# Altium schematic sheet Power.SchDoc
size Legal
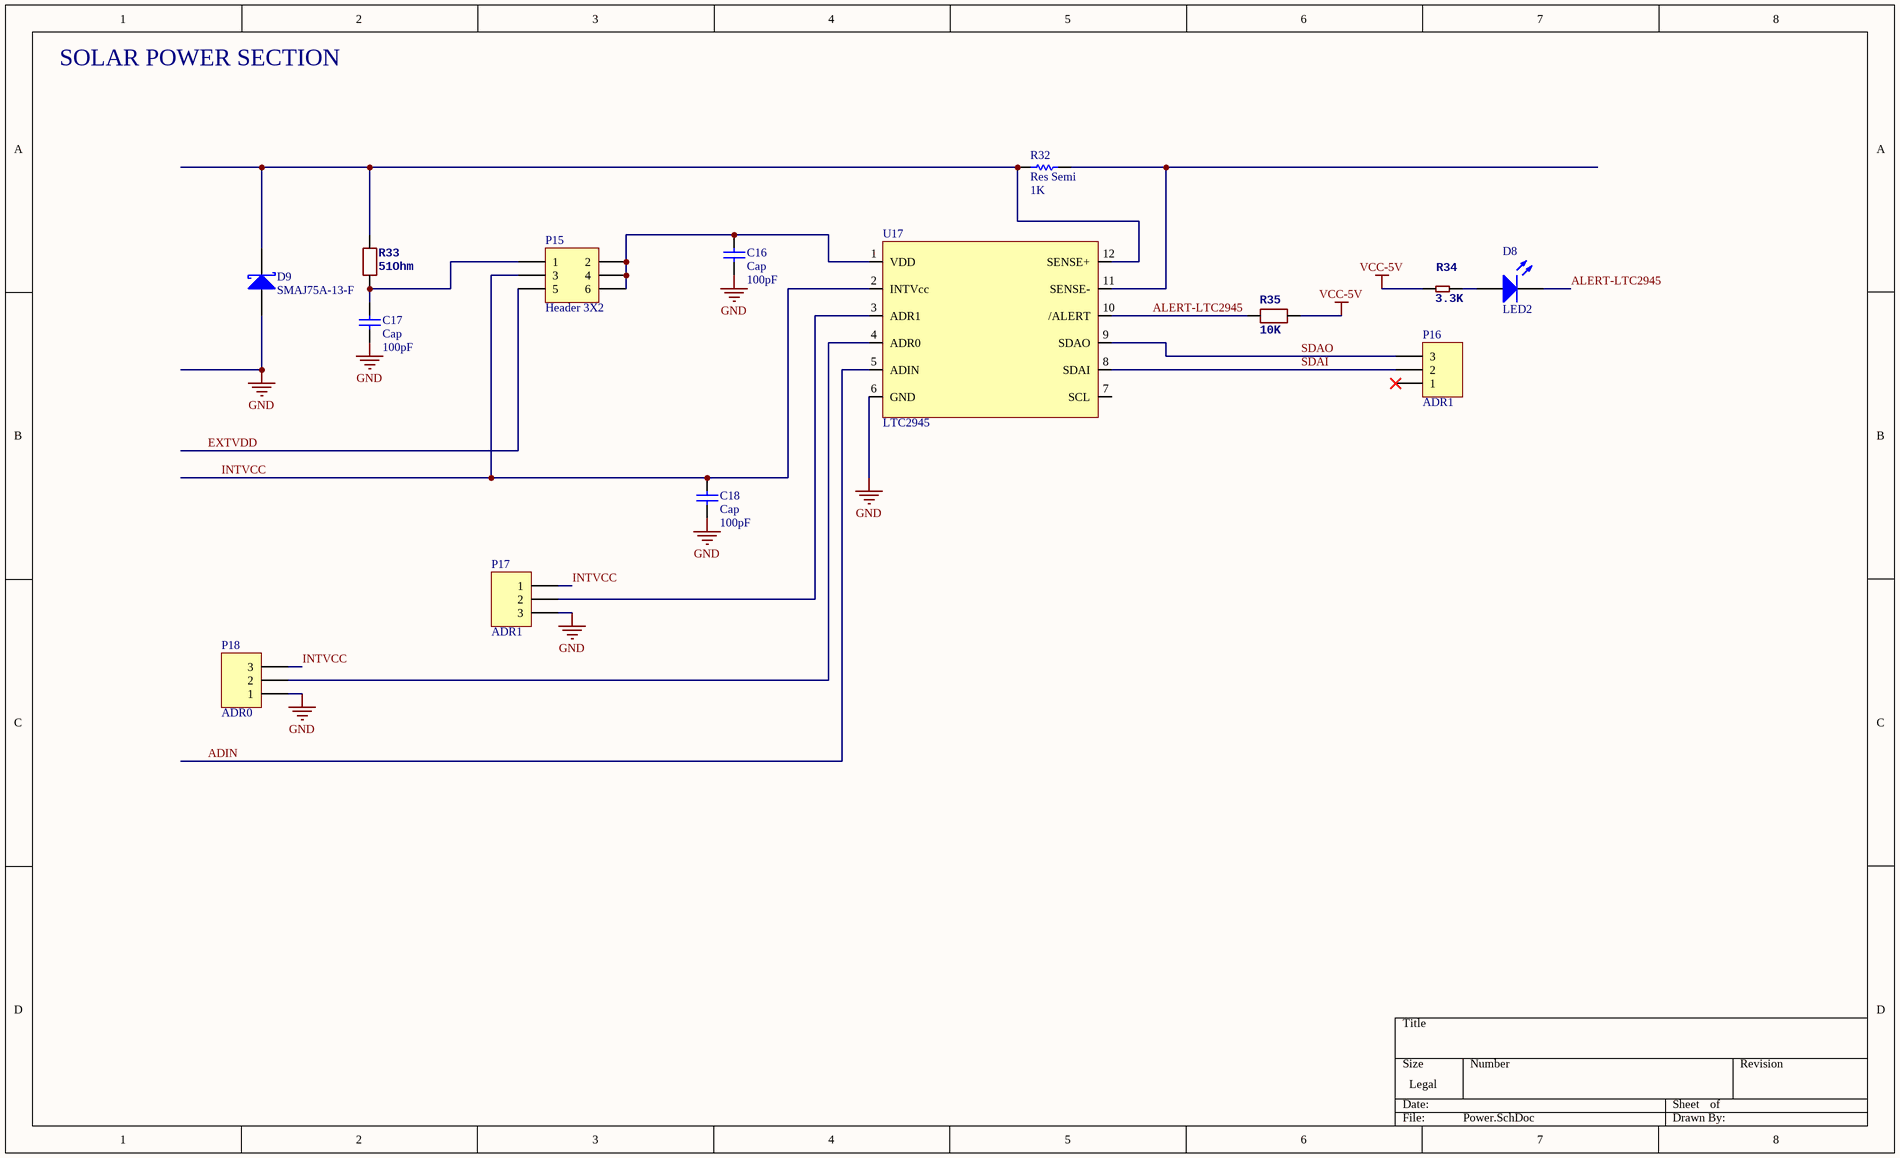
[diagram p0: Power.SchDoc]

## Parts
C16  Cap  value 100pF  [RAD-0.3]
C17  Cap  value 100pF  [RAD-0.3]
C18  Cap  value 100pF  [RAD-0.3]
D8  LED2  [3.2X1.6X1.1]
D9  SMAJ75A-13-F  [SMAJ5.0-TVS]
P15  Header 3X2  [HDR2X3]
P16  ADR1  [HDR1X3]
P17  ADR1  [HDR1X3]
P18  ADR0  [HDR1X3]
R32  Res Semi  value 1K  [AXIAL-0.5]
R33  51Ohm  [R0805]
R34  3.3K  [C1206]
R35  10K  [R0805]
U17  LTC2945

## Nets
GND: C16.1 C17.1 C18.1 D9.1(A) P17.3 P18.1 U17.6(GND)
VCC-5V: R34.1 R35.2
ADIN: U17.5(ADIN)
ALERT-LTC2945: D8.2(K) R35.1 U17.10(/ALERT)
EXTVDD: P15.5
INTVCC: C18.2 P15.3 P17.1 P18.3 U17.2(INTVcc)
SDAI: P16.2 U17.8(SDAI)
SDAO: P16.3 U17.9(SDAO)
NetC16_2: C16.2 P15.2 P15.4 P15.6 U17.1(VDD)
NetC17_2: C17.2 P15.1 R33.2
NetD8_1: D8.1(A) R34.2
NetD9_2: D9.2(K) R32.1 R33.1 U17.12(SENSE+)
NetP17_2: P17.2 U17.3(ADR1)
NetP18_2: P18.2 U17.4(ADR0)
NetR32_2: R32.2 U17.11(SENSE-)

Not connected (* = marked no-connect by the designer): P16 1*; U17 7(SCL)

## Notes on the sheet
- SOLAR POWER SECTION

## Library data of the parts
C16-C18 = Cap: Capacitor; Published: 8-Jun-2000; LatestRevisionDate: 17-Jul-2002; LatestRevisionNote: Re-released for DXP Platform.; PackageReference: RAD-0.3; Publisher: Altium Limited; PackageDescription: Radial Cap, Thru-Hole; 2 Leads; 0.3 in Pin Spacing
D8 = LED2: Typical RED, GREEN, YELLOW, AMBER GaAs LED; Published: 8-Jun-2000; LatestRevisionDate: 17-Jul-2002; LatestRevisionNote: Re-released for DXP Platform.; PackageVersion: Feb-2002; PackageReference: 3.2X1.6X1.1; Publisher: Altium Limited; PackageDescription: SM LED; 2 Flat Leads
D9 = D Schottky: SMA; Published: 8-Jun-2000; LatestRevisionDate: 17-Jul-2002; LatestRevisionNote: Re-released for DXP Platform.; PackageReference: SMB; Publisher: Altium Limited; PackageDescription: DO-214-AA/SMB; 2 C-Bend Leads; Body 5.3 x 3.6 mm, inc. leads (LxW); Code_JEDEC: DO-214-AA
P15 = Header 3X2: Header, 3-Pin, Dual row; LatestRevisionDate: 17-Jul-2002; LatestRevisionNote: Re-released for DXP Platform.; Publisher: Altium Limited
P16-P18 = Header 3: Header, 3-Pin; LatestRevisionDate: 17-Jul-2002; LatestRevisionNote: Re-released for DXP Platform.; Publisher: Altium Limited
R32 = Res Semi: Semiconductor Resistor; Published: 8-Jun-2000; LatestRevisionDate: 17-Jul-2002; LatestRevisionNote: Re-released for DXP Platform.; PackageReference: AXIAL-0.5; Publisher: Altium Limited; PackageDescription: Axial Device, Thru-Hole; 2 Leads; 0.5 in Pin Spacing
R33 R35 = RESISTOR0805_NOOUTLINE: Resistors   For new designs, use the packages preceded by an '_' character since they are more reliable:   The following footprints should be used on most boards: _0402 - Standard footprint for regular board layouts  _0603 - Standard footprint for regular board layouts  _0805 - Standard footprint for regular board layouts  _1206 - Standard footprint for regular board layouts       For extremely tight-pitch boards where space is at a premium, the following 'micro-pitch' footprints can be used (smaller pads, no silkscreen outline, etc.): _0402MP - Micro-pitch footprint for very dense/compact boards  _0603MP - Micro-pitch footprint for very dense/compact boards  _0805MP - Micro-pitch footprint for very dense/compact boards  _1206MP - Micro-pitch footprint for very dense/compact boards
R34 = SMD-RES-330R-1%-1/16W(0402): MPN: RC0402FR-07330RL
U17 = LTC2945: V I P Monitor I2C Interface